# Altium schematic sheet 05 SDRAM.SchDoc: SDRAM
size 420 x 297 mm; SheetNumber: 4; SheetTotal: 10
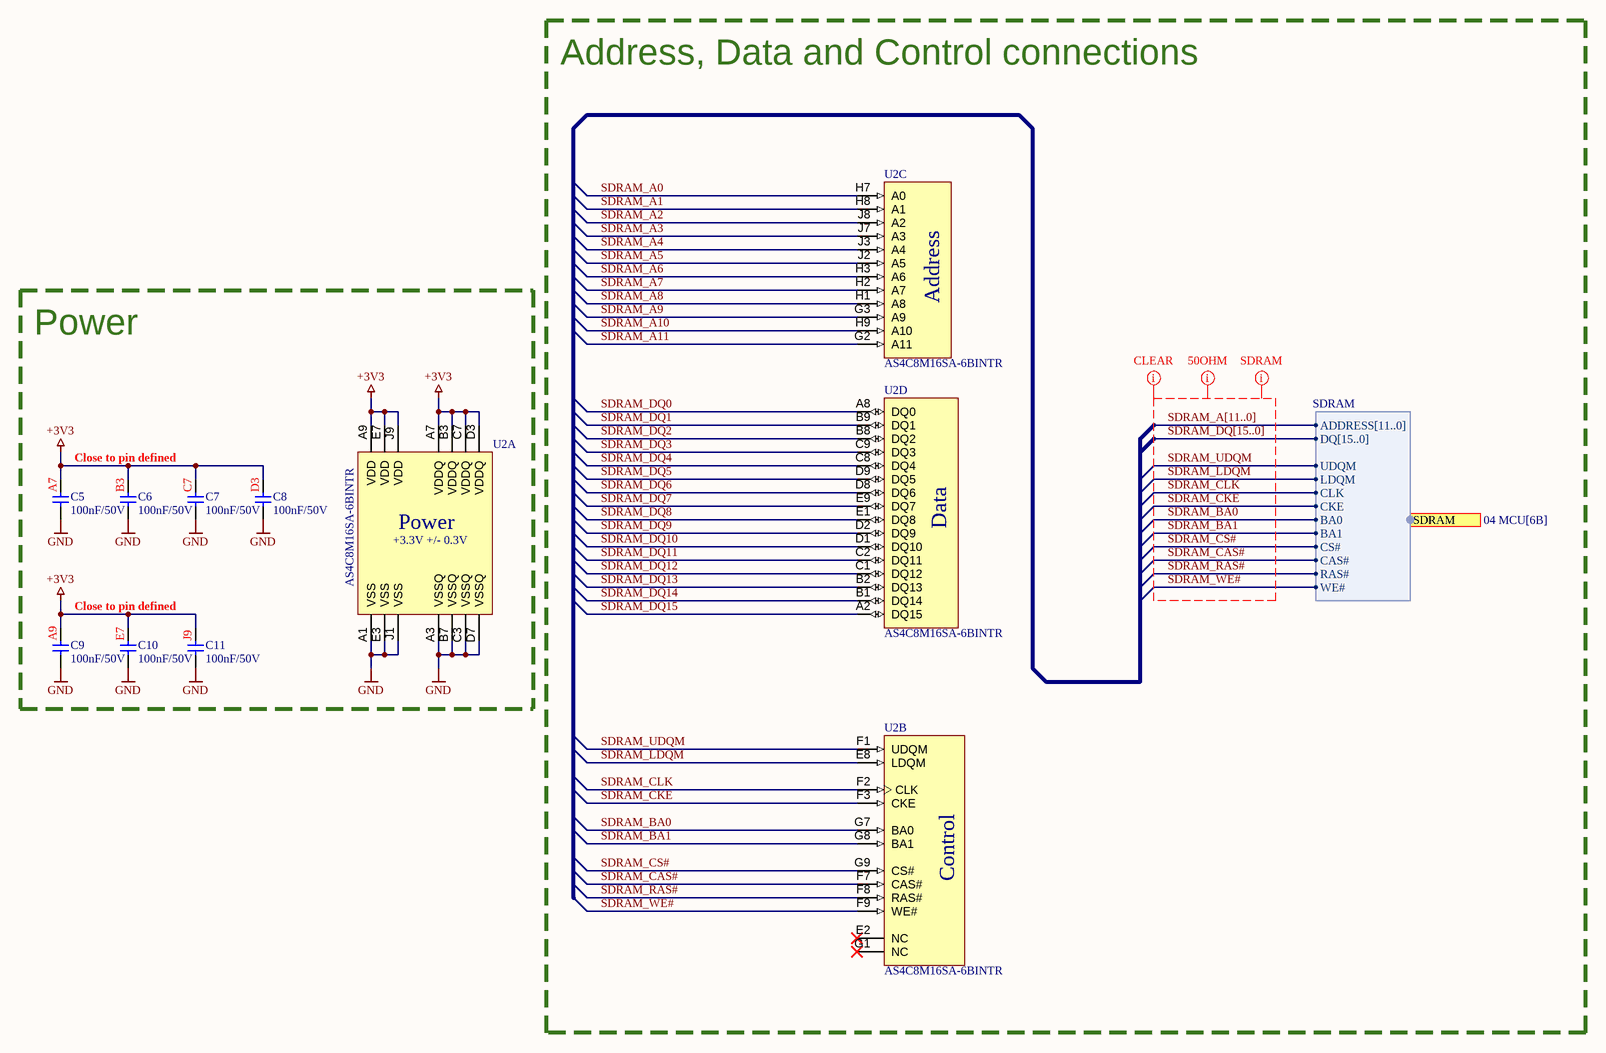
[diagram p0: 05 SDRAM.SchDoc]

## Parts
C5  100nF/50V  [CAPC1005X06M-0402]
C6  100nF/50V  [CAPC1005X06M-0402]
C7  100nF/50V  [CAPC1005X06M-0402]
C8  100nF/50V  [CAPC1005X06M-0402]
C9  100nF/50V  [CAPC1005X06M-0402]
C10  100nF/50V  [CAPC1005X06M-0402]
C11  100nF/50V  [CAPC1005X06M-0402]
U2  AS4C8M16SA-6BINTR  [TFBGA-54]  (parts A,B,C,D of 4)

## Blocks framed on the sheet
Address, Data and Control connections: U2
Power: C5-C11 U2

## Ports
SDRAM (harness SDRAM, see 04 MCU[6B])

## Harnesses
SDRAM: ADDRESS[11..0], DQ[15..0], UDQM, LDQM, CLK, CKE, BA0, BA1, CS#, CAS#, RAS#, WE#

## Nets
+3V3: C5.2 C6.2 C7.2 C8.2 C9.2 C10.2 C11.2 U2.A7(VDDQ) U2.A9(VDD) U2.B3(VDDQ) U2.C7(VDDQ) U2.D3(VDDQ) U2.E7(VDD) U2.J9(VDD)
GND: C5.1 C6.1 C7.1 C8.1 C9.1 C10.1 C11.1 U2.A1(VSS) U2.A3(VSSQ) U2.B7(VSSQ) U2.C3(VSSQ) U2.D7(VSSQ) U2.E3(VSS) U2.J1(VSS)
SDRAM_A0: U2.H7(A0)
SDRAM_A1: U2.H8(A1)
SDRAM_A2: U2.J8(A2)
SDRAM_A3: U2.J7(A3)
SDRAM_A4: U2.J3(A4)
SDRAM_A5: U2.J2(A5)
SDRAM_A6: U2.H3(A6)
SDRAM_A7: U2.H2(A7)
SDRAM_A8: U2.H1(A8)
SDRAM_A9: U2.G3(A9)
SDRAM_A10: U2.H9(A10)
SDRAM_A11: U2.G2(A11)
SDRAM_BA0: U2.G7(BA0) ; port SDRAM.BA0
SDRAM_BA1: U2.G8(BA1) ; port SDRAM.BA1
SDRAM_CAS#: U2.F7(CAS#) ; port SDRAM.CAS#
SDRAM_CKE: U2.F3(CKE) ; port SDRAM.CKE
SDRAM_CLK: U2.F2(CLK) ; port SDRAM.CLK
SDRAM_CS#: U2.G9(CS#) ; port SDRAM.CS#
SDRAM_DQ0: U2.A8(DQ0)
SDRAM_DQ1: U2.B9(DQ1)
SDRAM_DQ2: U2.B8(DQ2)
SDRAM_DQ3: U2.C9(DQ3)
SDRAM_DQ4: U2.C8(DQ4)
SDRAM_DQ5: U2.D9(DQ5)
SDRAM_DQ6: U2.D8(DQ6)
SDRAM_DQ7: U2.E9(DQ7)
SDRAM_DQ8: U2.E1(DQ8)
SDRAM_DQ9: U2.D2(DQ9)
SDRAM_DQ10: U2.D1(DQ10)
SDRAM_DQ11: U2.C2(DQ11)
SDRAM_DQ12: U2.C1(DQ12)
SDRAM_DQ13: U2.B2(DQ13)
SDRAM_DQ14: U2.B1(DQ14)
SDRAM_DQ15: U2.A2(DQ15)
SDRAM_LDQM: U2.E8(LDQM) ; port SDRAM.LDQM
SDRAM_RAS#: U2.F8(RAS#) ; port SDRAM.RAS#
SDRAM_UDQM: U2.F1(UDQM) ; port SDRAM.UDQM
SDRAM_WE#: U2.F9(WE#) ; port SDRAM.WE#

Not connected (* = marked no-connect by the designer): U2 E2(NC)* G1(NC)*

## Buses and harness runs
bus SDRAM_A[11..0]
bus SDRAM_DQ[15..0]

## Layout directives
net class SDRAM: SDRAM_A[11..0], SDRAM_BA0, SDRAM_BA1, SDRAM_CAS#, SDRAM_CKE, SDRAM_CLK, SDRAM_CS#, SDRAM_DQ[15..0], SDRAM_LDQM, SDRAM_RAS#, SDRAM_UDQM, SDRAM_WE#
net class 50OHM: SDRAM_A[11..0], SDRAM_BA0, SDRAM_BA1, SDRAM_CAS#, SDRAM_CKE, SDRAM_CLK, SDRAM_CS#, SDRAM_DQ[15..0], SDRAM_LDQM, SDRAM_RAS#, SDRAM_UDQM, SDRAM_WE#
net class CLEAR: SDRAM_A[11..0], SDRAM_BA0, SDRAM_BA1, SDRAM_CAS#, SDRAM_CKE, SDRAM_CLK, SDRAM_CS#, SDRAM_DQ[15..0], SDRAM_LDQM, SDRAM_RAS#, SDRAM_UDQM, SDRAM_WE#

## Notes on the sheet
- (near C5) A7
- Close to pin defined
- (near C6) B3
- (near C7) C7
- (near C8) D3
- (near C9) A9
- (near C10) E7
- (near C11) J9
- Title
- Project
- Size
- Date
- Revision
- A3
- Designed By
- (in symbol AS4C8M16SA-6BINTR, part A) Power; +3.3V +/- 0.3V
- (in symbol AS4C8M16SA-6BINTR, part B) Control
- (in symbol AS4C8M16SA-6BINTR, part C) Address
- (in symbol AS4C8M16SA-6BINTR, part D) Data

## Library data of the parts
C5-C11 = GRM155R71H104KE14D: 0.1 µF ±10% 50V Ceramic Capacitor X7R 0402 (1005 Metric); ComponentLink1Description: Datasheet; ComponentLink1URL: https://search.murata.co.jp/Ceramy/image/img/A01X/G101/ENG/GRM155R60J475ME47-01.pdf; MPN: GRM155R71H104KE14D
U2 = AS4C8M16SA-6BINTR: SDRAM Memory IC 128Mbit Parallel 166 MHz 5 ns 54-TFBGA (8x8); MPN: AS4C8M16SA-6BINTR; ComponentLink1Description: Datasheet; ComponentLink1URL: https://www.alliancememory.com/wp-content/uploads/pdf/dram/128M-AS4C8M16SA.pdf